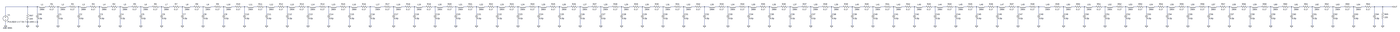
[diagram p0: schematic 64cell.asc, whole sheet]
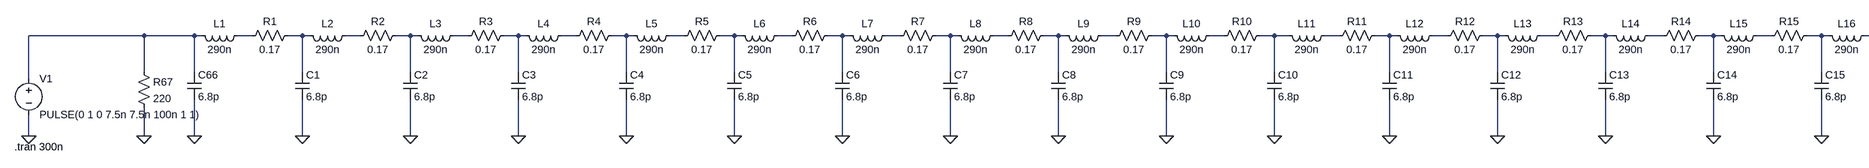
[diagram p1: schematic 64cell.asc, part, row 1 of 1, column 1 of 4]
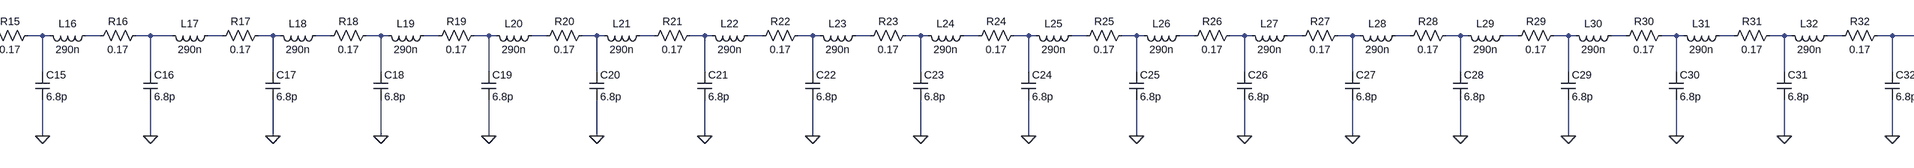
[diagram p2: schematic 64cell.asc, part, row 1 of 1, column 2 of 4]
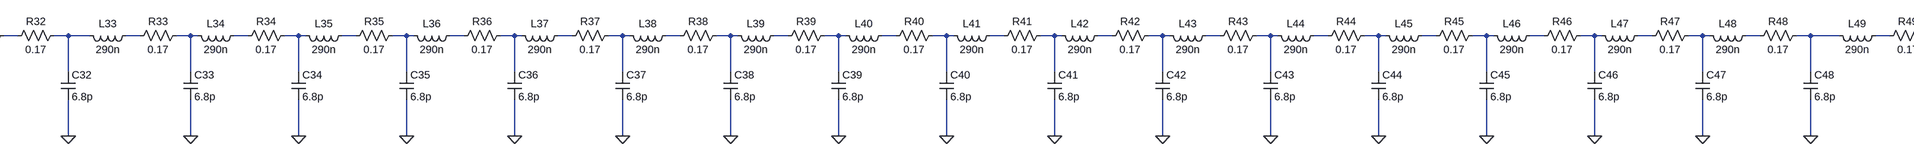
[diagram p3: schematic 64cell.asc, part, row 1 of 1, column 3 of 4]
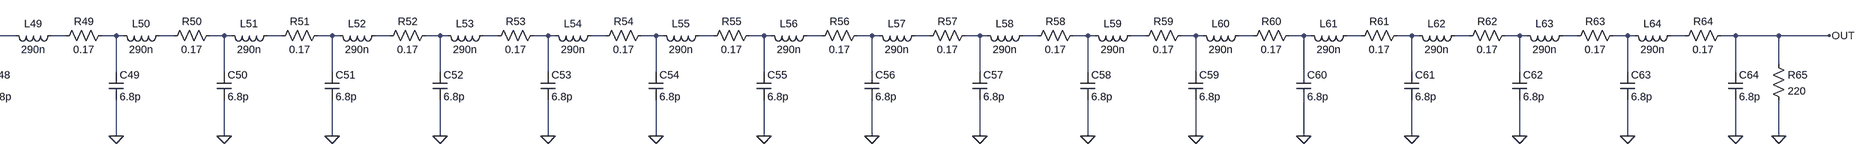
[diagram p4: schematic 64cell.asc, part, row 1 of 1, column 4 of 4]
64cell.asc, the LTspice schematic file:
Version 4
SHEET 1 8276 680
WIRE -7824 16 -8080 16
WIRE -7712 16 -7824 16
WIRE -7696 16 -7712 16
WIRE -7584 16 -7616 16
WIRE -7472 16 -7504 16
WIRE -7456 16 -7472 16
WIRE -7344 16 -7376 16
WIRE -7232 16 -7264 16
WIRE -7216 16 -7232 16
WIRE -7104 16 -7136 16
WIRE -6992 16 -7024 16
WIRE -6976 16 -6992 16
WIRE -6864 16 -6896 16
WIRE -6752 16 -6784 16
WIRE -6736 16 -6752 16
WIRE -6624 16 -6656 16
WIRE -6512 16 -6544 16
WIRE -6496 16 -6512 16
WIRE -6384 16 -6416 16
WIRE -6272 16 -6304 16
WIRE -6256 16 -6272 16
WIRE -6144 16 -6176 16
WIRE -6032 16 -6064 16
WIRE -6016 16 -6032 16
WIRE -5904 16 -5936 16
WIRE -5792 16 -5824 16
WIRE -5776 16 -5792 16
WIRE -5664 16 -5696 16
WIRE -5552 16 -5584 16
WIRE -5536 16 -5552 16
WIRE -5424 16 -5456 16
WIRE -5312 16 -5344 16
WIRE -5280 16 -5312 16
WIRE -5168 16 -5200 16
WIRE -5056 16 -5088 16
WIRE -5040 16 -5056 16
WIRE -4928 16 -4960 16
WIRE -4816 16 -4848 16
WIRE -4800 16 -4816 16
WIRE -4688 16 -4720 16
WIRE -4576 16 -4608 16
WIRE -4560 16 -4576 16
WIRE -4448 16 -4480 16
WIRE -4336 16 -4368 16
WIRE -4320 16 -4336 16
WIRE -4208 16 -4240 16
WIRE -4096 16 -4128 16
WIRE -4080 16 -4096 16
WIRE -3968 16 -4000 16
WIRE -3856 16 -3888 16
WIRE -3808 16 -3856 16
WIRE -3696 16 -3728 16
WIRE -3584 16 -3616 16
WIRE -3568 16 -3584 16
WIRE -3456 16 -3488 16
WIRE -3344 16 -3376 16
WIRE -3328 16 -3344 16
WIRE -3216 16 -3248 16
WIRE -3104 16 -3136 16
WIRE -3088 16 -3104 16
WIRE -2976 16 -3008 16
WIRE -2864 16 -2896 16
WIRE -2848 16 -2864 16
WIRE -2736 16 -2768 16
WIRE -2624 16 -2656 16
WIRE -2608 16 -2624 16
WIRE -2496 16 -2528 16
WIRE -2384 16 -2416 16
WIRE -2368 16 -2384 16
WIRE -2256 16 -2288 16
WIRE -2144 16 -2176 16
WIRE -2128 16 -2144 16
WIRE -2016 16 -2048 16
WIRE -1904 16 -1936 16
WIRE -1888 16 -1904 16
WIRE -1776 16 -1808 16
WIRE -1664 16 -1696 16
WIRE -1648 16 -1664 16
WIRE -1536 16 -1568 16
WIRE -1424 16 -1456 16
WIRE -1408 16 -1424 16
WIRE -1296 16 -1328 16
WIRE -1184 16 -1216 16
WIRE -1168 16 -1184 16
WIRE -1056 16 -1088 16
WIRE -944 16 -976 16
WIRE -928 16 -944 16
WIRE -816 16 -848 16
WIRE -704 16 -736 16
WIRE -688 16 -704 16
WIRE -576 16 -608 16
WIRE -464 16 -496 16
WIRE -448 16 -464 16
WIRE -336 16 -368 16
WIRE -224 16 -256 16
WIRE -208 16 -224 16
WIRE -96 16 -128 16
WIRE 16 16 -16 16
WIRE 64 16 16 16
WIRE 176 16 144 16
WIRE 288 16 256 16
WIRE 304 16 288 16
WIRE 416 16 384 16
WIRE 528 16 496 16
WIRE 544 16 528 16
WIRE 656 16 624 16
WIRE 768 16 736 16
WIRE 784 16 768 16
WIRE 896 16 864 16
WIRE 1008 16 976 16
WIRE 1024 16 1008 16
WIRE 1136 16 1104 16
WIRE 1248 16 1216 16
WIRE 1264 16 1248 16
WIRE 1376 16 1344 16
WIRE 1488 16 1456 16
WIRE 1504 16 1488 16
WIRE 1616 16 1584 16
WIRE 1728 16 1696 16
WIRE 1744 16 1728 16
WIRE 1856 16 1824 16
WIRE 1968 16 1936 16
WIRE 1984 16 1968 16
WIRE 2096 16 2064 16
WIRE 2208 16 2176 16
WIRE 2224 16 2208 16
WIRE 2336 16 2304 16
WIRE 2448 16 2416 16
WIRE 2464 16 2448 16
WIRE 2576 16 2544 16
WIRE 2688 16 2656 16
WIRE 2704 16 2688 16
WIRE 2816 16 2784 16
WIRE 2928 16 2896 16
WIRE 2944 16 2928 16
WIRE 3056 16 3024 16
WIRE 3168 16 3136 16
WIRE 3184 16 3168 16
WIRE 3296 16 3264 16
WIRE 3408 16 3376 16
WIRE 3424 16 3408 16
WIRE 3536 16 3504 16
WIRE 3648 16 3616 16
WIRE 3664 16 3648 16
WIRE 3776 16 3744 16
WIRE 3888 16 3856 16
WIRE 3952 16 3888 16
WIRE 4064 16 4032 16
WIRE 4176 16 4144 16
WIRE 4192 16 4176 16
WIRE 4304 16 4272 16
WIRE 4416 16 4384 16
WIRE 4432 16 4416 16
WIRE 4544 16 4512 16
WIRE 4656 16 4624 16
WIRE 4672 16 4656 16
WIRE 4784 16 4752 16
WIRE 4896 16 4864 16
WIRE 4912 16 4896 16
WIRE 5024 16 4992 16
WIRE 5136 16 5104 16
WIRE 5152 16 5136 16
WIRE 5264 16 5232 16
WIRE 5376 16 5344 16
WIRE 5392 16 5376 16
WIRE 5504 16 5472 16
WIRE 5616 16 5584 16
WIRE 5632 16 5616 16
WIRE 5744 16 5712 16
WIRE 5856 16 5824 16
WIRE 5872 16 5856 16
WIRE 5984 16 5952 16
WIRE 6096 16 6064 16
WIRE 6112 16 6096 16
WIRE 6224 16 6192 16
WIRE 6336 16 6304 16
WIRE 6352 16 6336 16
WIRE 6464 16 6432 16
WIRE 6576 16 6544 16
WIRE 6592 16 6576 16
WIRE 6704 16 6672 16
WIRE 6816 16 6784 16
WIRE 6832 16 6816 16
WIRE 6944 16 6912 16
WIRE 7056 16 7024 16
WIRE 7072 16 7056 16
WIRE 7184 16 7152 16
WIRE 7296 16 7264 16
WIRE 7312 16 7296 16
WIRE 7424 16 7392 16
WIRE 7536 16 7504 16
WIRE 7552 16 7536 16
WIRE 7664 16 7632 16
WIRE 7776 16 7744 16
WIRE 7872 16 7776 16
WIRE 7984 16 7872 16
WIRE 7872 80 7872 16
WIRE -7824 96 -7824 16
WIRE -7712 96 -7712 16
WIRE -7472 96 -7472 16
WIRE -7232 96 -7232 16
WIRE -6992 96 -6992 16
WIRE -6752 96 -6752 16
WIRE -6512 96 -6512 16
WIRE -6272 96 -6272 16
WIRE -6032 96 -6032 16
WIRE -5792 96 -5792 16
WIRE -5552 96 -5552 16
WIRE -5312 96 -5312 16
WIRE -5056 96 -5056 16
WIRE -4816 96 -4816 16
WIRE -4576 96 -4576 16
WIRE -4336 96 -4336 16
WIRE -4096 96 -4096 16
WIRE -3856 96 -3856 16
WIRE -3584 96 -3584 16
WIRE -3344 96 -3344 16
WIRE -3104 96 -3104 16
WIRE -2864 96 -2864 16
WIRE -2624 96 -2624 16
WIRE -2384 96 -2384 16
WIRE -2144 96 -2144 16
WIRE -1904 96 -1904 16
WIRE -1664 96 -1664 16
WIRE -1424 96 -1424 16
WIRE -1184 96 -1184 16
WIRE -944 96 -944 16
WIRE -704 96 -704 16
WIRE -464 96 -464 16
WIRE -224 96 -224 16
WIRE 16 96 16 16
WIRE 288 96 288 16
WIRE 528 96 528 16
WIRE 768 96 768 16
WIRE 1008 96 1008 16
WIRE 1248 96 1248 16
WIRE 1488 96 1488 16
WIRE 1728 96 1728 16
WIRE 1968 96 1968 16
WIRE 2208 96 2208 16
WIRE 2448 96 2448 16
WIRE 2688 96 2688 16
WIRE 2928 96 2928 16
WIRE 3168 96 3168 16
WIRE 3408 96 3408 16
WIRE 3648 96 3648 16
WIRE 3888 96 3888 16
WIRE 4176 96 4176 16
WIRE 4416 96 4416 16
WIRE 4656 96 4656 16
WIRE 4896 96 4896 16
WIRE 5136 96 5136 16
WIRE 5376 96 5376 16
WIRE 5616 96 5616 16
WIRE 5856 96 5856 16
WIRE 6096 96 6096 16
WIRE 6336 96 6336 16
WIRE 6576 96 6576 16
WIRE 6816 96 6816 16
WIRE 7056 96 7056 16
WIRE 7296 96 7296 16
WIRE 7536 96 7536 16
WIRE 7776 96 7776 16
WIRE -8080 112 -8080 16
WIRE -8080 240 -8080 192
WIRE -7824 240 -7824 176
WIRE -7712 240 -7712 160
WIRE -7472 240 -7472 160
WIRE -7232 240 -7232 160
WIRE -6992 240 -6992 160
WIRE -6752 240 -6752 160
WIRE -6512 240 -6512 160
WIRE -6272 240 -6272 160
WIRE -6032 240 -6032 160
WIRE -5792 240 -5792 160
WIRE -5552 240 -5552 160
WIRE -5312 240 -5312 160
WIRE -5056 240 -5056 160
WIRE -4816 240 -4816 160
WIRE -4576 240 -4576 160
WIRE -4336 240 -4336 160
WIRE -4096 240 -4096 160
WIRE -3856 240 -3856 160
WIRE -3584 240 -3584 160
WIRE -3344 240 -3344 160
WIRE -3104 240 -3104 160
WIRE -2864 240 -2864 160
WIRE -2624 240 -2624 160
WIRE -2384 240 -2384 160
WIRE -2144 240 -2144 160
WIRE -1904 240 -1904 160
WIRE -1664 240 -1664 160
WIRE -1424 240 -1424 160
WIRE -1184 240 -1184 160
WIRE -944 240 -944 160
WIRE -704 240 -704 160
WIRE -464 240 -464 160
WIRE -224 240 -224 160
WIRE 16 240 16 160
WIRE 288 240 288 160
WIRE 528 240 528 160
WIRE 768 240 768 160
WIRE 1008 240 1008 160
WIRE 1248 240 1248 160
WIRE 1488 240 1488 160
WIRE 1728 240 1728 160
WIRE 1968 240 1968 160
WIRE 2208 240 2208 160
WIRE 2448 240 2448 160
WIRE 2688 240 2688 160
WIRE 2928 240 2928 160
WIRE 3168 240 3168 160
WIRE 3408 240 3408 160
WIRE 3648 240 3648 160
WIRE 3888 240 3888 160
WIRE 4176 240 4176 160
WIRE 4416 240 4416 160
WIRE 4656 240 4656 160
WIRE 4896 240 4896 160
WIRE 5136 240 5136 160
WIRE 5376 240 5376 160
WIRE 5616 240 5616 160
WIRE 5856 240 5856 160
WIRE 6096 240 6096 160
WIRE 6336 240 6336 160
WIRE 6576 240 6576 160
WIRE 6816 240 6816 160
WIRE 7056 240 7056 160
WIRE 7296 240 7296 160
WIRE 7536 240 7536 160
WIRE 7776 240 7776 160
WIRE 7872 240 7872 160
FLAG -8080 240 0
FLAG -7712 240 0
FLAG -7472 240 0
FLAG -7232 240 0
FLAG -6992 240 0
FLAG -6752 240 0
FLAG -6512 240 0
FLAG -6272 240 0
FLAG -6032 240 0
FLAG -5792 240 0
FLAG -5552 240 0
FLAG -5312 240 0
FLAG -5056 240 0
FLAG -4816 240 0
FLAG -4576 240 0
FLAG -4336 240 0
FLAG -4096 240 0
FLAG -3856 240 0
FLAG -3584 240 0
FLAG -3344 240 0
FLAG -3104 240 0
FLAG -2864 240 0
FLAG -2624 240 0
FLAG -2384 240 0
FLAG -2144 240 0
FLAG -1904 240 0
FLAG -1664 240 0
FLAG -1424 240 0
FLAG -1184 240 0
FLAG -944 240 0
FLAG -704 240 0
FLAG -464 240 0
FLAG -224 240 0
FLAG 16 240 0
FLAG 288 240 0
FLAG 528 240 0
FLAG 768 240 0
FLAG 1008 240 0
FLAG 1248 240 0
FLAG 1488 240 0
FLAG 1728 240 0
FLAG 1968 240 0
FLAG 2208 240 0
FLAG 2448 240 0
FLAG 2688 240 0
FLAG 2928 240 0
FLAG 3168 240 0
FLAG 3408 240 0
FLAG 3648 240 0
FLAG 3888 240 0
FLAG 4176 240 0
FLAG 4416 240 0
FLAG 4656 240 0
FLAG 4896 240 0
FLAG 5136 240 0
FLAG 5376 240 0
FLAG 5616 240 0
FLAG 5856 240 0
FLAG 6096 240 0
FLAG 6336 240 0
FLAG 6576 240 0
FLAG 6816 240 0
FLAG 7056 240 0
FLAG 7296 240 0
FLAG 7536 240 0
FLAG 7776 240 0
FLAG 7872 240 0
FLAG -7824 240 0
FLAG 7984 16 OUT
SYMBOL voltage -8080 96 R0
WINDOW 123 0 0 Left 0
WINDOW 39 0 0 Left 0
SYMATTR InstName V1
SYMATTR Value PULSE(0 1 0 7.5n 7.5n 100n 1 1)
SYMBOL ind -7600 0 R90
WINDOW 0 5 56 VBottom 2
WINDOW 3 32 56 VTop 2
SYMATTR InstName L1
SYMATTR Value 290n
SYMBOL res -7488 0 R90
WINDOW 0 0 56 VBottom 2
WINDOW 3 32 56 VTop 2
SYMATTR InstName R1
SYMATTR Value 0.17
SYMBOL cap -7488 96 R0
SYMATTR InstName C1
SYMATTR Value 6.8p
SYMBOL ind -7360 0 R90
WINDOW 0 5 56 VBottom 2
WINDOW 3 32 56 VTop 2
SYMATTR InstName L2
SYMATTR Value 290n
SYMBOL res -7248 0 R90
WINDOW 0 0 56 VBottom 2
WINDOW 3 32 56 VTop 2
SYMATTR InstName R2
SYMATTR Value 0.17
SYMBOL cap -7248 96 R0
SYMATTR InstName C2
SYMATTR Value 6.8p
SYMBOL ind -7120 0 R90
WINDOW 0 5 56 VBottom 2
WINDOW 3 32 56 VTop 2
SYMATTR InstName L3
SYMATTR Value 290n
SYMBOL res -7008 0 R90
WINDOW 0 0 56 VBottom 2
WINDOW 3 32 56 VTop 2
SYMATTR InstName R3
SYMATTR Value 0.17
SYMBOL cap -7008 96 R0
SYMATTR InstName C3
SYMATTR Value 6.8p
SYMBOL ind -6880 0 R90
WINDOW 0 5 56 VBottom 2
WINDOW 3 32 56 VTop 2
SYMATTR InstName L4
SYMATTR Value 290n
SYMBOL res -6768 0 R90
WINDOW 0 0 56 VBottom 2
WINDOW 3 32 56 VTop 2
SYMATTR InstName R4
SYMATTR Value 0.17
SYMBOL cap -6768 96 R0
SYMATTR InstName C4
SYMATTR Value 6.8p
SYMBOL ind -6640 0 R90
WINDOW 0 5 56 VBottom 2
WINDOW 3 32 56 VTop 2
SYMATTR InstName L5
SYMATTR Value 290n
SYMBOL res -6528 0 R90
WINDOW 0 0 56 VBottom 2
WINDOW 3 32 56 VTop 2
SYMATTR InstName R5
SYMATTR Value 0.17
SYMBOL cap -6528 96 R0
SYMATTR InstName C5
SYMATTR Value 6.8p
SYMBOL ind -6400 0 R90
WINDOW 0 5 56 VBottom 2
WINDOW 3 32 56 VTop 2
SYMATTR InstName L6
SYMATTR Value 290n
SYMBOL res -6288 0 R90
WINDOW 0 0 56 VBottom 2
WINDOW 3 32 56 VTop 2
SYMATTR InstName R6
SYMATTR Value 0.17
SYMBOL cap -6288 96 R0
SYMATTR InstName C6
SYMATTR Value 6.8p
SYMBOL ind -6160 0 R90
WINDOW 0 5 56 VBottom 2
WINDOW 3 32 56 VTop 2
SYMATTR InstName L7
SYMATTR Value 290n
SYMBOL res -6048 0 R90
WINDOW 0 0 56 VBottom 2
WINDOW 3 32 56 VTop 2
SYMATTR InstName R7
SYMATTR Value 0.17
SYMBOL cap -6048 96 R0
SYMATTR InstName C7
SYMATTR Value 6.8p
SYMBOL ind -5920 0 R90
WINDOW 0 5 56 VBottom 2
WINDOW 3 32 56 VTop 2
SYMATTR InstName L8
SYMATTR Value 290n
SYMBOL res -5808 0 R90
WINDOW 0 0 56 VBottom 2
WINDOW 3 32 56 VTop 2
SYMATTR InstName R8
SYMATTR Value 0.17
SYMBOL cap -5808 96 R0
SYMATTR InstName C8
SYMATTR Value 6.8p
SYMBOL ind -5680 0 R90
WINDOW 0 5 56 VBottom 2
WINDOW 3 32 56 VTop 2
SYMATTR InstName L9
SYMATTR Value 290n
SYMBOL res -5568 0 R90
WINDOW 0 0 56 VBottom 2
WINDOW 3 32 56 VTop 2
SYMATTR InstName R9
SYMATTR Value 0.17
SYMBOL cap -5568 96 R0
SYMATTR InstName C9
SYMATTR Value 6.8p
SYMBOL ind -5440 0 R90
WINDOW 0 5 56 VBottom 2
WINDOW 3 32 56 VTop 2
SYMATTR InstName L10
SYMATTR Value 290n
SYMBOL res -5328 0 R90
WINDOW 0 0 56 VBottom 2
WINDOW 3 32 56 VTop 2
SYMATTR InstName R10
SYMATTR Value 0.17
SYMBOL cap -5328 96 R0
SYMATTR InstName C10
SYMATTR Value 6.8p
SYMBOL ind -5184 0 R90
WINDOW 0 5 56 VBottom 2
WINDOW 3 32 56 VTop 2
SYMATTR InstName L11
SYMATTR Value 290n
SYMBOL res -5072 0 R90
WINDOW 0 0 56 VBottom 2
WINDOW 3 32 56 VTop 2
SYMATTR InstName R11
SYMATTR Value 0.17
SYMBOL cap -5072 96 R0
SYMATTR InstName C11
SYMATTR Value 6.8p
SYMBOL ind -4944 0 R90
WINDOW 0 5 56 VBottom 2
WINDOW 3 32 56 VTop 2
SYMATTR InstName L12
SYMATTR Value 290n
SYMBOL res -4832 0 R90
WINDOW 0 0 56 VBottom 2
WINDOW 3 32 56 VTop 2
SYMATTR InstName R12
SYMATTR Value 0.17
SYMBOL cap -4832 96 R0
SYMATTR InstName C12
SYMATTR Value 6.8p
SYMBOL ind -4704 0 R90
WINDOW 0 5 56 VBottom 2
WINDOW 3 32 56 VTop 2
SYMATTR InstName L13
SYMATTR Value 290n
SYMBOL res -4592 0 R90
WINDOW 0 0 56 VBottom 2
WINDOW 3 32 56 VTop 2
SYMATTR InstName R13
SYMATTR Value 0.17
SYMBOL cap -4592 96 R0
SYMATTR InstName C13
SYMATTR Value 6.8p
SYMBOL ind -4464 0 R90
WINDOW 0 5 56 VBottom 2
WINDOW 3 32 56 VTop 2
SYMATTR InstName L14
SYMATTR Value 290n
SYMBOL res -4352 0 R90
WINDOW 0 0 56 VBottom 2
WINDOW 3 32 56 VTop 2
SYMATTR InstName R14
SYMATTR Value 0.17
SYMBOL cap -4352 96 R0
SYMATTR InstName C14
SYMATTR Value 6.8p
SYMBOL ind -4224 0 R90
WINDOW 0 5 56 VBottom 2
WINDOW 3 32 56 VTop 2
SYMATTR InstName L15
SYMATTR Value 290n
SYMBOL res -4112 0 R90
WINDOW 0 0 56 VBottom 2
WINDOW 3 32 56 VTop 2
SYMATTR InstName R15
SYMATTR Value 0.17
SYMBOL cap -4112 96 R0
SYMATTR InstName C15
SYMATTR Value 6.8p
SYMBOL ind -3984 0 R90
WINDOW 0 5 56 VBottom 2
WINDOW 3 32 56 VTop 2
SYMATTR InstName L16
SYMATTR Value 290n
SYMBOL res -3872 0 R90
WINDOW 0 0 56 VBottom 2
WINDOW 3 32 56 VTop 2
SYMATTR InstName R16
SYMATTR Value 0.17
SYMBOL cap -3872 96 R0
SYMATTR InstName C16
SYMATTR Value 6.8p
SYMBOL ind -3712 0 R90
WINDOW 0 5 56 VBottom 2
WINDOW 3 32 56 VTop 2
SYMATTR InstName L17
SYMATTR Value 290n
SYMBOL res -3600 0 R90
WINDOW 0 0 56 VBottom 2
WINDOW 3 32 56 VTop 2
SYMATTR InstName R17
SYMATTR Value 0.17
SYMBOL cap -3600 96 R0
SYMATTR InstName C17
SYMATTR Value 6.8p
SYMBOL ind -3472 0 R90
WINDOW 0 5 56 VBottom 2
WINDOW 3 32 56 VTop 2
SYMATTR InstName L18
SYMATTR Value 290n
SYMBOL res -3360 0 R90
WINDOW 0 0 56 VBottom 2
WINDOW 3 32 56 VTop 2
SYMATTR InstName R18
SYMATTR Value 0.17
SYMBOL cap -3360 96 R0
SYMATTR InstName C18
SYMATTR Value 6.8p
SYMBOL ind -3232 0 R90
WINDOW 0 5 56 VBottom 2
WINDOW 3 32 56 VTop 2
SYMATTR InstName L19
SYMATTR Value 290n
SYMBOL res -3120 0 R90
WINDOW 0 0 56 VBottom 2
WINDOW 3 32 56 VTop 2
SYMATTR InstName R19
SYMATTR Value 0.17
SYMBOL cap -3120 96 R0
SYMATTR InstName C19
SYMATTR Value 6.8p
SYMBOL ind -2992 0 R90
WINDOW 0 5 56 VBottom 2
WINDOW 3 32 56 VTop 2
SYMATTR InstName L20
SYMATTR Value 290n
SYMBOL res -2880 0 R90
WINDOW 0 0 56 VBottom 2
WINDOW 3 32 56 VTop 2
SYMATTR InstName R20
SYMATTR Value 0.17
SYMBOL cap -2880 96 R0
SYMATTR InstName C20
SYMATTR Value 6.8p
SYMBOL ind -2752 0 R90
WINDOW 0 5 56 VBottom 2
WINDOW 3 32 56 VTop 2
SYMATTR InstName L21
SYMATTR Value 290n
SYMBOL res -2640 0 R90
WINDOW 0 0 56 VBottom 2
WINDOW 3 32 56 VTop 2
SYMATTR InstName R21
SYMATTR Value 0.17
SYMBOL cap -2640 96 R0
SYMATTR InstName C21
SYMATTR Value 6.8p
SYMBOL ind -2512 0 R90
WINDOW 0 5 56 VBottom 2
WINDOW 3 32 56 VTop 2
SYMATTR InstName L22
SYMATTR Value 290n
SYMBOL res -2400 0 R90
WINDOW 0 0 56 VBottom 2
WINDOW 3 32 56 VTop 2
SYMATTR InstName R22
SYMATTR Value 0.17
SYMBOL cap -2400 96 R0
SYMATTR InstName C22
SYMATTR Value 6.8p
SYMBOL ind -2272 0 R90
WINDOW 0 5 56 VBottom 2
WINDOW 3 32 56 VTop 2
SYMATTR InstName L23
SYMATTR Value 290n
SYMBOL res -2160 0 R90
WINDOW 0 0 56 VBottom 2
WINDOW 3 32 56 VTop 2
SYMATTR InstName R23
SYMATTR Value 0.17
SYMBOL cap -2160 96 R0
SYMATTR InstName C23
SYMATTR Value 6.8p
SYMBOL ind -2032 0 R90
WINDOW 0 5 56 VBottom 2
WINDOW 3 32 56 VTop 2
SYMATTR InstName L24
SYMATTR Value 290n
SYMBOL res -1920 0 R90
WINDOW 0 0 56 VBottom 2
WINDOW 3 32 56 VTop 2
SYMATTR InstName R24
SYMATTR Value 0.17
SYMBOL cap -1920 96 R0
SYMATTR InstName C24
SYMATTR Value 6.8p
SYMBOL ind -1792 0 R90
WINDOW 0 5 56 VBottom 2
WINDOW 3 32 56 VTop 2
SYMATTR InstName L25
SYMATTR Value 290n
SYMBOL res -1680 0 R90
WINDOW 0 0 56 VBottom 2
WINDOW 3 32 56 VTop 2
SYMATTR InstName R25
SYMATTR Value 0.17
SYMBOL cap -1680 96 R0
SYMATTR InstName C25
SYMATTR Value 6.8p
SYMBOL ind -1552 0 R90
WINDOW 0 5 56 VBottom 2
WINDOW 3 32 56 VTop 2
SYMATTR InstName L26
SYMATTR Value 290n
SYMBOL res -1440 0 R90
WINDOW 0 0 56 VBottom 2
WINDOW 3 32 56 VTop 2
SYMATTR InstName R26
SYMATTR Value 0.17
SYMBOL cap -1440 96 R0
SYMATTR InstName C26
SYMATTR Value 6.8p
SYMBOL ind -1312 0 R90
WINDOW 0 5 56 VBottom 2
WINDOW 3 32 56 VTop 2
SYMATTR InstName L27
SYMATTR Value 290n
SYMBOL res -1200 0 R90
WINDOW 0 0 56 VBottom 2
WINDOW 3 32 56 VTop 2
SYMATTR InstName R27
SYMATTR Value 0.17
SYMBOL cap -1200 96 R0
SYMATTR InstName C27
SYMATTR Value 6.8p
SYMBOL ind -1072 0 R90
WINDOW 0 5 56 VBottom 2
WINDOW 3 32 56 VTop 2
SYMATTR InstName L28
SYMATTR Value 290n
SYMBOL res -960 0 R90
WINDOW 0 0 56 VBottom 2
WINDOW 3 32 56 VTop 2
SYMATTR InstName R28
SYMATTR Value 0.17
SYMBOL cap -960 96 R0
SYMATTR InstName C28
SYMATTR Value 6.8p
SYMBOL ind -832 0 R90
WINDOW 0 5 56 VBottom 2
WINDOW 3 32 56 VTop 2
SYMATTR InstName L29
SYMATTR Value 290n
SYMBOL res -720 0 R90
WINDOW 0 0 56 VBottom 2
WINDOW 3 32 56 VTop 2
SYMATTR InstName R29
SYMATTR Value 0.17
SYMBOL cap -720 96 R0
SYMATTR InstName C29
SYMATTR Value 6.8p
SYMBOL ind -592 0 R90
WINDOW 0 5 56 VBottom 2
WINDOW 3 32 56 VTop 2
SYMATTR InstName L30
SYMATTR Value 290n
SYMBOL res -480 0 R90
WINDOW 0 0 56 VBottom 2
WINDOW 3 32 56 VTop 2
SYMATTR InstName R30
SYMATTR Value 0.17
SYMBOL cap -480 96 R0
SYMATTR InstName C30
SYMATTR Value 6.8p
SYMBOL ind -352 0 R90
WINDOW 0 5 56 VBottom 2
WINDOW 3 32 56 VTop 2
SYMATTR InstName L31
SYMATTR Value 290n
SYMBOL res -240 0 R90
WINDOW 0 0 56 VBottom 2
WINDOW 3 32 56 VTop 2
SYMATTR InstName R31
SYMATTR Value 0.17
SYMBOL cap -240 96 R0
SYMATTR InstName C31
SYMATTR Value 6.8p
SYMBOL ind -112 0 R90
WINDOW 0 5 56 VBottom 2
WINDOW 3 32 56 VTop 2
SYMATTR InstName L32
SYMATTR Value 290n
SYMBOL res 0 0 R90
WINDOW 0 0 56 VBottom 2
WINDOW 3 32 56 VTop 2
SYMATTR InstName R32
SYMATTR Value 0.17
SYMBOL cap 0 96 R0
SYMATTR InstName C32
SYMATTR Value 6.8p
SYMBOL ind 160 0 R90
WINDOW 0 5 56 VBottom 2
WINDOW 3 32 56 VTop 2
SYMATTR InstName L33
SYMATTR Value 290n
SYMBOL res 272 0 R90
WINDOW 0 0 56 VBottom 2
WINDOW 3 32 56 VTop 2
SYMATTR InstName R33
SYMATTR Value 0.17
SYMBOL cap 272 96 R0
SYMATTR InstName C33
SYMATTR Value 6.8p
SYMBOL ind 400 0 R90
WINDOW 0 5 56 VBottom 2
WINDOW 3 32 56 VTop 2
SYMATTR InstName L34
SYMATTR Value 290n
SYMBOL res 512 0 R90
WINDOW 0 0 56 VBottom 2
WINDOW 3 32 56 VTop 2
SYMATTR InstName R34
SYMATTR Value 0.17
SYMBOL cap 512 96 R0
SYMATTR InstName C34
SYMATTR Value 6.8p
SYMBOL ind 640 0 R90
WINDOW 0 5 56 VBottom 2
WINDOW 3 32 56 VTop 2
SYMATTR InstName L35
SYMATTR Value 290n
SYMBOL res 752 0 R90
WINDOW 0 0 56 VBottom 2
WINDOW 3 32 56 VTop 2
SYMATTR InstName R35
SYMATTR Value 0.17
SYMBOL cap 752 96 R0
SYMATTR InstName C35
SYMATTR Value 6.8p
SYMBOL ind 880 0 R90
WINDOW 0 5 56 VBottom 2
WINDOW 3 32 56 VTop 2
SYMATTR InstName L36
SYMATTR Value 290n
SYMBOL res 992 0 R90
WINDOW 0 0 56 VBottom 2
WINDOW 3 32 56 VTop 2
SYMATTR InstName R36
SYMATTR Value 0.17
SYMBOL cap 992 96 R0
SYMATTR InstName C36
SYMATTR Value 6.8p
SYMBOL ind 1120 0 R90
WINDOW 0 5 56 VBottom 2
WINDOW 3 32 56 VTop 2
SYMATTR InstName L37
SYMATTR Value 290n
SYMBOL res 1232 0 R90
WINDOW 0 0 56 VBottom 2
WINDOW 3 32 56 VTop 2
SYMATTR InstName R37
SYMATTR Value 0.17
SYMBOL cap 1232 96 R0
SYMATTR InstName C37
SYMATTR Value 6.8p
SYMBOL ind 1360 0 R90
WINDOW 0 5 56 VBottom 2
WINDOW 3 32 56 VTop 2
SYMATTR InstName L38
SYMATTR Value 290n
SYMBOL res 1472 0 R90
WINDOW 0 0 56 VBottom 2
WINDOW 3 32 56 VTop 2
SYMATTR InstName R38
SYMATTR Value 0.17
SYMBOL cap 1472 96 R0
SYMATTR InstName C38
SYMATTR Value 6.8p
SYMBOL ind 1600 0 R90
WINDOW 0 5 56 VBottom 2
WINDOW 3 32 56 VTop 2
SYMATTR InstName L39
SYMATTR Value 290n
SYMBOL res 1712 0 R90
WINDOW 0 0 56 VBottom 2
WINDOW 3 32 56 VTop 2
SYMATTR InstName R39
SYMATTR Value 0.17
SYMBOL cap 1712 96 R0
SYMATTR InstName C39
SYMATTR Value 6.8p
SYMBOL ind 1840 0 R90
WINDOW 0 5 56 VBottom 2
WINDOW 3 32 56 VTop 2
SYMATTR InstName L40
SYMATTR Value 290n
SYMBOL res 1952 0 R90
WINDOW 0 0 56 VBottom 2
WINDOW 3 32 56 VTop 2
SYMATTR InstName R40
SYMATTR Value 0.17
SYMBOL cap 1952 96 R0
SYMATTR InstName C40
SYMATTR Value 6.8p
SYMBOL ind 2080 0 R90
WINDOW 0 5 56 VBottom 2
WINDOW 3 32 56 VTop 2
SYMATTR InstName L41
SYMATTR Value 290n
SYMBOL res 2192 0 R90
WINDOW 0 0 56 VBottom 2
WINDOW 3 32 56 VTop 2
SYMATTR InstName R41
SYMATTR Value 0.17
SYMBOL cap 2192 96 R0
SYMATTR InstName C41
SYMATTR Value 6.8p
SYMBOL ind 2320 0 R90
WINDOW 0 5 56 VBottom 2
WINDOW 3 32 56 VTop 2
SYMATTR InstName L42
SYMATTR Value 290n
SYMBOL res 2432 0 R90
WINDOW 0 0 56 VBottom 2
WINDOW 3 32 56 VTop 2
SYMATTR InstName R42
SYMATTR Value 0.17
SYMBOL cap 2432 96 R0
SYMATTR InstName C42
SYMATTR Value 6.8p
SYMBOL ind 2560 0 R90
WINDOW 0 5 56 VBottom 2
WINDOW 3 32 56 VTop 2
SYMATTR InstName L43
SYMATTR Value 290n
SYMBOL res 2672 0 R90
WINDOW 0 0 56 VBottom 2
WINDOW 3 32 56 VTop 2
SYMATTR InstName R43
SYMATTR Value 0.17
SYMBOL cap 2672 96 R0
SYMATTR InstName C43
SYMATTR Value 6.8p
SYMBOL ind 2800 0 R90
WINDOW 0 5 56 VBottom 2
WINDOW 3 32 56 VTop 2
SYMATTR InstName L44
SYMATTR Value 290n
SYMBOL res 2912 0 R90
WINDOW 0 0 56 VBottom 2
WINDOW 3 32 56 VTop 2
SYMATTR InstName R44
SYMATTR Value 0.17
SYMBOL cap 2912 96 R0
SYMATTR InstName C44
SYMATTR Value 6.8p
SYMBOL ind 3040 0 R90
WINDOW 0 5 56 VBottom 2
WINDOW 3 32 56 VTop 2
SYMATTR InstName L45
SYMATTR Value 290n
SYMBOL res 3152 0 R90
WINDOW 0 0 56 VBottom 2
WINDOW 3 32 56 VTop 2
SYMATTR InstName R45
SYMATTR Value 0.17
SYMBOL cap 3152 96 R0
SYMATTR InstName C45
SYMATTR Value 6.8p
SYMBOL ind 3280 0 R90
WINDOW 0 5 56 VBottom 2
WINDOW 3 32 56 VTop 2
SYMATTR InstName L46
SYMATTR Value 290n
SYMBOL res 3392 0 R90
WINDOW 0 0 56 VBottom 2
WINDOW 3 32 56 VTop 2
SYMATTR InstName R46
SYMATTR Value 0.17
SYMBOL cap 3392 96 R0
SYMATTR InstName C46
SYMATTR Value 6.8p
SYMBOL ind 3520 0 R90
WINDOW 0 5 56 VBottom 2
WINDOW 3 32 56 VTop 2
SYMATTR InstName L47
SYMATTR Value 290n
SYMBOL res 3632 0 R90
WINDOW 0 0 56 VBottom 2
WINDOW 3 32 56 VTop 2
SYMATTR InstName R47
SYMATTR Value 0.17
SYMBOL cap 3632 96 R0
SYMATTR InstName C47
SYMATTR Value 6.8p
SYMBOL ind 3760 0 R90
WINDOW 0 5 56 VBottom 2
WINDOW 3 32 56 VTop 2
SYMATTR InstName L48
SYMATTR Value 290n
SYMBOL res 3872 0 R90
WINDOW 0 0 56 VBottom 2
WINDOW 3 32 56 VTop 2
SYMATTR InstName R48
SYMATTR Value 0.17
SYMBOL cap 3872 96 R0
SYMATTR InstName C48
SYMATTR Value 6.8p
SYMBOL ind 4048 0 R90
WINDOW 0 5 56 VBottom 2
WINDOW 3 32 56 VTop 2
SYMATTR InstName L49
SYMATTR Value 290n
SYMBOL res 4160 0 R90
WINDOW 0 0 56 VBottom 2
WINDOW 3 32 56 VTop 2
SYMATTR InstName R49
SYMATTR Value 0.17
SYMBOL cap 4160 96 R0
SYMATTR InstName C49
SYMATTR Value 6.8p
SYMBOL ind 4288 0 R90
WINDOW 0 5 56 VBottom 2
WINDOW 3 32 56 VTop 2
SYMATTR InstName L50
SYMATTR Value 290n
SYMBOL res 4400 0 R90
WINDOW 0 0 56 VBottom 2
WINDOW 3 32 56 VTop 2
SYMATTR InstName R50
SYMATTR Value 0.17
SYMBOL cap 4400 96 R0
SYMATTR InstName C50
SYMATTR Value 6.8p
SYMBOL ind 4528 0 R90
WINDOW 0 5 56 VBottom 2
WINDOW 3 32 56 VTop 2
SYMATTR InstName L51
SYMATTR Value 290n
SYMBOL res 4640 0 R90
WINDOW 0 0 56 VBottom 2
WINDOW 3 32 56 VTop 2
SYMATTR InstName R51
SYMATTR Value 0.17
SYMBOL cap 4640 96 R0
SYMATTR InstName C51
SYMATTR Value 6.8p
SYMBOL ind 4768 0 R90
WINDOW 0 5 56 VBottom 2
WINDOW 3 32 56 VTop 2
SYMATTR InstName L52
SYMATTR Value 290n
SYMBOL res 4880 0 R90
WINDOW 0 0 56 VBottom 2
WINDOW 3 32 56 VTop 2
SYMATTR InstName R52
SYMATTR Value 0.17
SYMBOL cap 4880 96 R0
SYMATTR InstName C52
SYMATTR Value 6.8p
SYMBOL ind 5008 0 R90
WINDOW 0 5 56 VBottom 2
WINDOW 3 32 56 VTop 2
SYMATTR InstName L53
SYMATTR Value 290n
SYMBOL res 5120 0 R90
WINDOW 0 0 56 VBottom 2
WINDOW 3 32 56 VTop 2
SYMATTR InstName R53
SYMATTR Value 0.17
SYMBOL cap 5120 96 R0
SYMATTR InstName C53
SYMATTR Value 6.8p
SYMBOL ind 5248 0 R90
WINDOW 0 5 56 VBottom 2
WINDOW 3 32 56 VTop 2
SYMATTR InstName L54
SYMATTR Value 290n
SYMBOL res 5360 0 R90
WINDOW 0 0 56 VBottom 2
WINDOW 3 32 56 VTop 2
SYMATTR InstName R54
SYMATTR Value 0.17
SYMBOL cap 5360 96 R0
SYMATTR InstName C54
SYMATTR Value 6.8p
SYMBOL ind 5488 0 R90
WINDOW 0 5 56 VBottom 2
WINDOW 3 32 56 VTop 2
SYMATTR InstName L55
SYMATTR Value 290n
SYMBOL res 5600 0 R90
WINDOW 0 0 56 VBottom 2
WINDOW 3 32 56 VTop 2
SYMATTR InstName R55
SYMATTR Value 0.17
SYMBOL cap 5600 96 R0
SYMATTR InstName C55
SYMATTR Value 6.8p
SYMBOL ind 5728 0 R90
WINDOW 0 5 56 VBottom 2
WINDOW 3 32 56 VTop 2
SYMATTR InstName L56
SYMATTR Value 290n
SYMBOL res 5840 0 R90
WINDOW 0 0 56 VBottom 2
WINDOW 3 32 56 VTop 2
SYMATTR InstName R56
SYMATTR Value 0.17
SYMBOL cap 5840 96 R0
SYMATTR InstName C56
SYMATTR Value 6.8p
SYMBOL ind 5968 0 R90
WINDOW 0 5 56 VBottom 2
WINDOW 3 32 56 VTop 2
SYMATTR InstName L57
SYMATTR Value 290n
SYMBOL res 6080 0 R90
WINDOW 0 0 56 VBottom 2
WINDOW 3 32 56 VTop 2
SYMATTR InstName R57
SYMATTR Value 0.17
SYMBOL cap 6080 96 R0
SYMATTR InstName C57
SYMATTR Value 6.8p
SYMBOL ind 6208 0 R90
WINDOW 0 5 56 VBottom 2
WINDOW 3 32 56 VTop 2
SYMATTR InstName L58
SYMATTR Value 290n
SYMBOL res 6320 0 R90
WINDOW 0 0 56 VBottom 2
WINDOW 3 32 56 VTop 2
SYMATTR InstName R58
SYMATTR Value 0.17
SYMBOL cap 6320 96 R0
SYMATTR InstName C58
SYMATTR Value 6.8p
SYMBOL ind 6448 0 R90
WINDOW 0 5 56 VBottom 2
WINDOW 3 32 56 VTop 2
SYMATTR InstName L59
SYMATTR Value 290n
SYMBOL res 6560 0 R90
WINDOW 0 0 56 VBottom 2
WINDOW 3 32 56 VTop 2
SYMATTR InstName R59
SYMATTR Value 0.17
SYMBOL cap 6560 96 R0
SYMATTR InstName C59
SYMATTR Value 6.8p
SYMBOL ind 6688 0 R90
WINDOW 0 5 56 VBottom 2
WINDOW 3 32 56 VTop 2
SYMATTR InstName L60
SYMATTR Value 290n
SYMBOL res 6800 0 R90
WINDOW 0 0 56 VBottom 2
WINDOW 3 32 56 VTop 2
SYMATTR InstName R60
SYMATTR Value 0.17
SYMBOL cap 6800 96 R0
SYMATTR InstName C60
SYMATTR Value 6.8p
SYMBOL ind 6928 0 R90
WINDOW 0 5 56 VBottom 2
WINDOW 3 32 56 VTop 2
SYMATTR InstName L61
SYMATTR Value 290n
SYMBOL res 7040 0 R90
WINDOW 0 0 56 VBottom 2
WINDOW 3 32 56 VTop 2
SYMATTR InstName R61
SYMATTR Value 0.17
SYMBOL cap 7040 96 R0
SYMATTR InstName C61
SYMATTR Value 6.8p
SYMBOL ind 7168 0 R90
WINDOW 0 5 56 VBottom 2
WINDOW 3 32 56 VTop 2
SYMATTR InstName L62
SYMATTR Value 290n
SYMBOL res 7280 0 R90
WINDOW 0 0 56 VBottom 2
WINDOW 3 32 56 VTop 2
SYMATTR InstName R62
SYMATTR Value 0.17
SYMBOL cap 7280 96 R0
SYMATTR InstName C62
SYMATTR Value 6.8p
SYMBOL ind 7408 0 R90
WINDOW 0 5 56 VBottom 2
WINDOW 3 32 56 VTop 2
SYMATTR InstName L63
SYMATTR Value 290n
SYMBOL res 7520 0 R90
WINDOW 0 0 56 VBottom 2
WINDOW 3 32 56 VTop 2
SYMATTR InstName R63
SYMATTR Value 0.17
SYMBOL cap 7520 96 R0
SYMATTR InstName C63
SYMATTR Value 6.8p
SYMBOL ind 7648 0 R90
WINDOW 0 5 56 VBottom 2
WINDOW 3 32 56 VTop 2
SYMATTR InstName L64
SYMATTR Value 290n
SYMBOL res 7760 0 R90
WINDOW 0 0 56 VBottom 2
WINDOW 3 32 56 VTop 2
SYMATTR InstName R64
SYMATTR Value 0.17
SYMBOL cap 7760 96 R0
SYMATTR InstName C64
SYMATTR Value 6.8p
SYMBOL res 7856 64 R0
SYMATTR InstName R65
SYMATTR Value 220
SYMBOL res -7840 80 R0
SYMATTR InstName R67
SYMATTR Value 220
SYMBOL cap -7728 96 R0
SYMATTR InstName C66
SYMATTR Value 6.8p
TEXT -8112 264 Left 2 !.tran 300n

The netlist it stands for:
* 64cell.asc
V1 N001 0 PULSE(0 1 0 7.5n 7.5n 100n 1 1)
L1 N002 N001 290n
R1 N003 N002 0.17
C1 N003 0 6.8p
L2 N004 N003 290n
R2 N005 N004 0.17
C2 N005 0 6.8p
L3 N006 N005 290n
R3 N007 N006 0.17
C3 N007 0 6.8p
L4 N008 N007 290n
R4 N009 N008 0.17
C4 N009 0 6.8p
L5 N010 N009 290n
R5 N011 N010 0.17
C5 N011 0 6.8p
L6 N012 N011 290n
R6 N013 N012 0.17
C6 N013 0 6.8p
L7 N014 N013 290n
R7 N015 N014 0.17
C7 N015 0 6.8p
L8 N016 N015 290n
R8 N017 N016 0.17
C8 N017 0 6.8p
L9 N018 N017 290n
R9 N019 N018 0.17
C9 N019 0 6.8p
L10 N020 N019 290n
R10 N021 N020 0.17
C10 N021 0 6.8p
L11 N022 N021 290n
R11 N023 N022 0.17
C11 N023 0 6.8p
L12 N024 N023 290n
R12 N025 N024 0.17
C12 N025 0 6.8p
L13 N026 N025 290n
R13 N027 N026 0.17
C13 N027 0 6.8p
L14 N028 N027 290n
R14 N029 N028 0.17
C14 N029 0 6.8p
L15 N030 N029 290n
R15 N031 N030 0.17
C15 N031 0 6.8p
L16 N032 N031 290n
R16 N033 N032 0.17
C16 N033 0 6.8p
L17 N034 N033 290n
R17 N035 N034 0.17
C17 N035 0 6.8p
L18 N036 N035 290n
R18 N037 N036 0.17
C18 N037 0 6.8p
L19 N038 N037 290n
R19 N039 N038 0.17
C19 N039 0 6.8p
L20 N040 N039 290n
R20 N041 N040 0.17
C20 N041 0 6.8p
L21 N042 N041 290n
R21 N043 N042 0.17
C21 N043 0 6.8p
L22 N044 N043 290n
R22 N045 N044 0.17
C22 N045 0 6.8p
L23 N046 N045 290n
R23 N047 N046 0.17
C23 N047 0 6.8p
L24 N048 N047 290n
R24 N049 N048 0.17
C24 N049 0 6.8p
L25 N050 N049 290n
R25 N051 N050 0.17
C25 N051 0 6.8p
L26 N052 N051 290n
R26 N053 N052 0.17
C26 N053 0 6.8p
L27 N054 N053 290n
R27 N055 N054 0.17
C27 N055 0 6.8p
L28 N056 N055 290n
R28 N057 N056 0.17
C28 N057 0 6.8p
L29 N058 N057 290n
R29 N059 N058 0.17
C29 N059 0 6.8p
L30 N060 N059 290n
R30 N061 N060 0.17
C30 N061 0 6.8p
L31 N062 N061 290n
R31 N063 N062 0.17
C31 N063 0 6.8p
L32 N064 N063 290n
R32 N065 N064 0.17
C32 N065 0 6.8p
L33 N066 N065 290n
R33 N067 N066 0.17
C33 N067 0 6.8p
L34 N068 N067 290n
R34 N069 N068 0.17
C34 N069 0 6.8p
L35 N070 N069 290n
R35 N071 N070 0.17
C35 N071 0 6.8p
L36 N072 N071 290n
R36 N073 N072 0.17
C36 N073 0 6.8p
L37 N074 N073 290n
R37 N075 N074 0.17
C37 N075 0 6.8p
L38 N076 N075 290n
R38 N077 N076 0.17
C38 N077 0 6.8p
L39 N078 N077 290n
R39 N079 N078 0.17
C39 N079 0 6.8p
L40 N080 N079 290n
R40 N081 N080 0.17
C40 N081 0 6.8p
L41 N082 N081 290n
R41 N083 N082 0.17
C41 N083 0 6.8p
L42 N084 N083 290n
R42 N085 N084 0.17
C42 N085 0 6.8p
L43 N086 N085 290n
R43 N087 N086 0.17
C43 N087 0 6.8p
L44 N088 N087 290n
R44 N089 N088 0.17
C44 N089 0 6.8p
L45 N090 N089 290n
R45 N091 N090 0.17
C45 N091 0 6.8p
L46 N092 N091 290n
R46 N093 N092 0.17
C46 N093 0 6.8p
L47 N094 N093 290n
R47 N095 N094 0.17
C47 N095 0 6.8p
L48 N096 N095 290n
R48 N097 N096 0.17
C48 N097 0 6.8p
L49 N098 N097 290n
R49 N099 N098 0.17
C49 N099 0 6.8p
L50 N100 N099 290n
R50 N101 N100 0.17
C50 N101 0 6.8p
L51 N102 N101 290n
R51 N103 N102 0.17
C51 N103 0 6.8p
L52 N104 N103 290n
R52 N105 N104 0.17
C52 N105 0 6.8p
L53 N106 N105 290n
R53 N107 N106 0.17
C53 N107 0 6.8p
L54 N108 N107 290n
R54 N109 N108 0.17
C54 N109 0 6.8p
L55 N110 N109 290n
R55 N111 N110 0.17
C55 N111 0 6.8p
L56 N112 N111 290n
R56 N113 N112 0.17
C56 N113 0 6.8p
L57 N114 N113 290n
R57 N115 N114 0.17
C57 N115 0 6.8p
L58 N116 N115 290n
R58 N117 N116 0.17
C58 N117 0 6.8p
L59 N118 N117 290n
R59 N119 N118 0.17
C59 N119 0 6.8p
L60 N120 N119 290n
R60 N121 N120 0.17
C60 N121 0 6.8p
L61 N122 N121 290n
R61 N123 N122 0.17
C61 N123 0 6.8p
L62 N124 N123 290n
R62 N125 N124 0.17
C62 N125 0 6.8p
L63 N126 N125 290n
R63 N127 N126 0.17
C63 N127 0 6.8p
L64 N128 N127 290n
R64 OUT N128 0.17
C64 OUT 0 6.8p
R65 OUT 0 220
R67 N001 0 220
C66 N001 0 6.8p
.tran 300n
.backanno
.end